# EAGLE design PiCB (EAGLE 8.0.1)
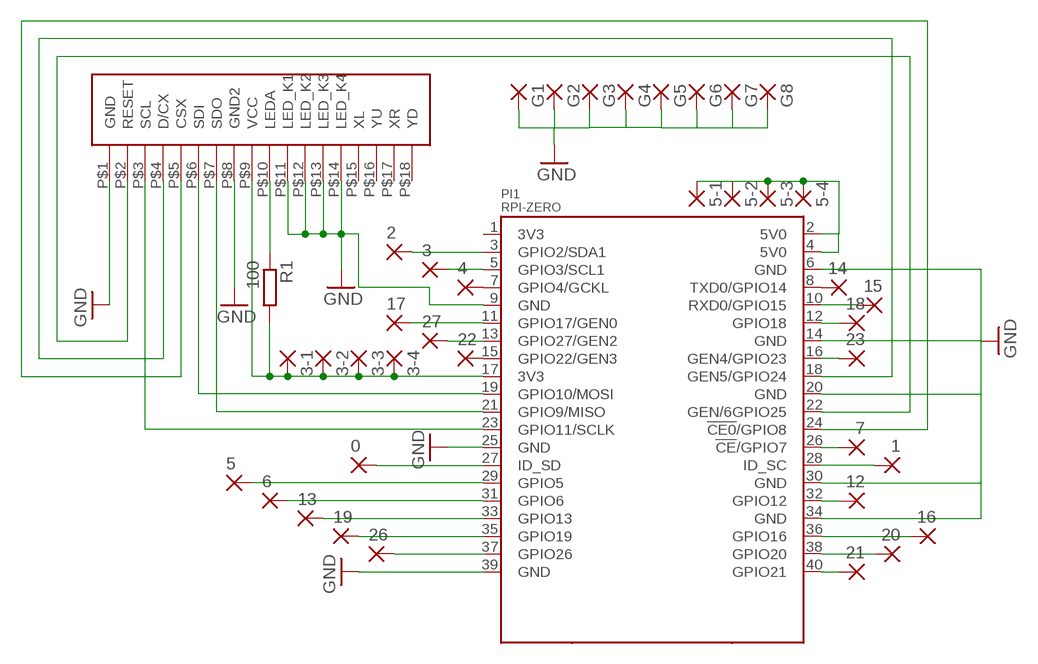
[diagram p0: schematic, sheet 1]

## Parts
0  1,6/0,8  [1,6/0,8]
1  1,6/0,8  [1,6/0,8]
2  1,6/0,8  [1,6/0,8]
3  1,6/0,8  [1,6/0,8]
3-1  1,6/0,8  [1,6/0,8]
3-2  1,6/0,8  [1,6/0,8]
3-3  1,6/0,8  [1,6/0,8]
3-4  1,6/0,8  [1,6/0,8]
4  1,6/0,8  [1,6/0,8]
5  1,6/0,8  [1,6/0,8]
5-1  1,6/0,8  [1,6/0,8]
5-2  1,6/0,8  [1,6/0,8]
5-3  1,6/0,8  [1,6/0,8]
5-4  1,6/0,8  [1,6/0,8]
6  1,6/0,8  [1,6/0,8]
7  1,6/0,8  [1,6/0,8]
12  1,6/0,8  [1,6/0,8]
13  1,6/0,8  [1,6/0,8]
14  1,6/0,8  [1,6/0,8]
15  1,6/0,8  [1,6/0,8]
16  1,6/0,8  [1,6/0,8]
17  1,6/0,8  [1,6/0,8]
18  1,6/0,8  [1,6/0,8]
19  1,6/0,8  [1,6/0,8]
20  1,6/0,8  [1,6/0,8]
21  1,6/0,8  [1,6/0,8]
22  1,6/0,8  [1,6/0,8]
23  1,6/0,8  [1,6/0,8]
26  1,6/0,8  [1,6/0,8]
27  1,6/0,8  [1,6/0,8]
G1  1,6/0,8  [1,6/0,8]
G2  1,6/0,8  [1,6/0,8]
G3  1,6/0,8  [1,6/0,8]
G4  1,6/0,8  [1,6/0,8]
G5  1,6/0,8  [1,6/0,8]
G6  1,6/0,8  [1,6/0,8]
G7  1,6/0,8  [1,6/0,8]
G8  1,6/0,8  [1,6/0,8]
PI1  RPI-ZERO  [RASPBERRYPI_BASTELSTUBE_V13_RASPI_BOARD_B+_FULL]
R1  100  R-EU_R0805  [R0805]
U$2  ILI9341-2.8  [ILI9341-2.8]

## Nets
5V0@2: 5-1.1(P) 5-2.1(P) 5-3.1(P) 5-4.1(P) PI1.2(5V0) PI1.4(5V0)
GND: G1.1(P) G2.1(P) G3.1(P) G4.1(P) G5.1(P) G6.1(P) G7.1(P) G8.1(P) PI1.39(GND) U$2.P$1(GND) U$2.P$8(GND2)
GND@1: PI1.9(GND) U$2.P$11(LED_K1) U$2.P$12(LED_K2) U$2.P$13(LED_K3) U$2.P$14(LED_K4) ; supply symbol labelled GND
GND@2: PI1.25(GND) ; supply symbol labelled GND
GND@7: PI1.6(GND) PI1.14(GND) PI1.20(GND) PI1.30(GND) PI1.34(GND) ; supply symbol labelled GND
N$1: PI1.22(GEN/6GPIO25) U$2.P$2(RESET)
N$2: PI1.23(GPIO11/SCLK) U$2.P$3(SCL)
N$3: PI1.19(GPIO10/MOSI) U$2.P$6(SDI)
N$4: PI1.21(GPIO9/MISO) U$2.P$7(SDO)
N$5: R1.1 U$2.P$10(LEDA)
N$6: PI1.18(GEN5/GPIO24) U$2.P$4(D/CX)
N$7: PI1.24(!CE0!/GPIO8) U$2.P$5(CSX)
N$8: 26.1(P) PI1.37(GPIO26)
N$9: 19.1(P) PI1.35(GPIO19)
N$10: 13.1(P) PI1.33(GPIO13)
N$11: 6.1(P) PI1.31(GPIO6)
N$12: 5.1(P) PI1.29(GPIO5)
N$13: 21.1(P) PI1.40(GPIO21)
N$14: 20.1(P) PI1.38(GPIO20)
N$15: 16.1(P) PI1.36(GPIO16)
N$16: 12.1(P) PI1.32(GPIO12)
N$17: 7.1(P) PI1.26(!CE!/GPIO7)
N$18: 14.1(P) PI1.8(TXD0/GPIO14)
N$19: 3-1.1(P) 3-2.1(P) 3-3.1(P) 3-4.1(P) PI1.17(3V3) R1.2 U$2.P$9(VCC)
N$20: 23.1(P) PI1.16(GEN4/GPIO23)
N$21: 18.1(P) PI1.12(GPIO18)
N$22: 15.1(P) PI1.10(RXD0/GPIO15)
N$23: 22.1(P) PI1.15(GPIO22/GEN3)
N$24: 4.1(P) PI1.7(GPIO4/GCKL)
N$25: 27.1(P) PI1.13(GPIO27/GEN2)
N$26: 17.1(P) PI1.11(GPIO17/GEN0)
N$27: 3.1(P) PI1.5(GPIO3/SCL1)
N$28: 2.1(P) PI1.3(GPIO2/SDA1)
N$31: 0.1(P) PI1.27(ID_SD)
N$32: 1.1(P) PI1.28(ID_SC)
Unconnected: PI1.1(3V3) U$2.P$15(XL) U$2.P$16(YU) U$2.P$17(XR) U$2.P$18(YD)

## Library data of the parts
0 1-3 3-1-3-4 4 5 5-1-5-4 6 7 12-23 26 27 G1-G8 = wirepad:1,6/0,8: THROUGH-HOLE PAD
PI1 = RPI-Zero:RPI-ZERO
R1 = resistor:R-EU_: RESISTOR, European symbol
U$2 = ili9341:ILI9341-2.8

## Board
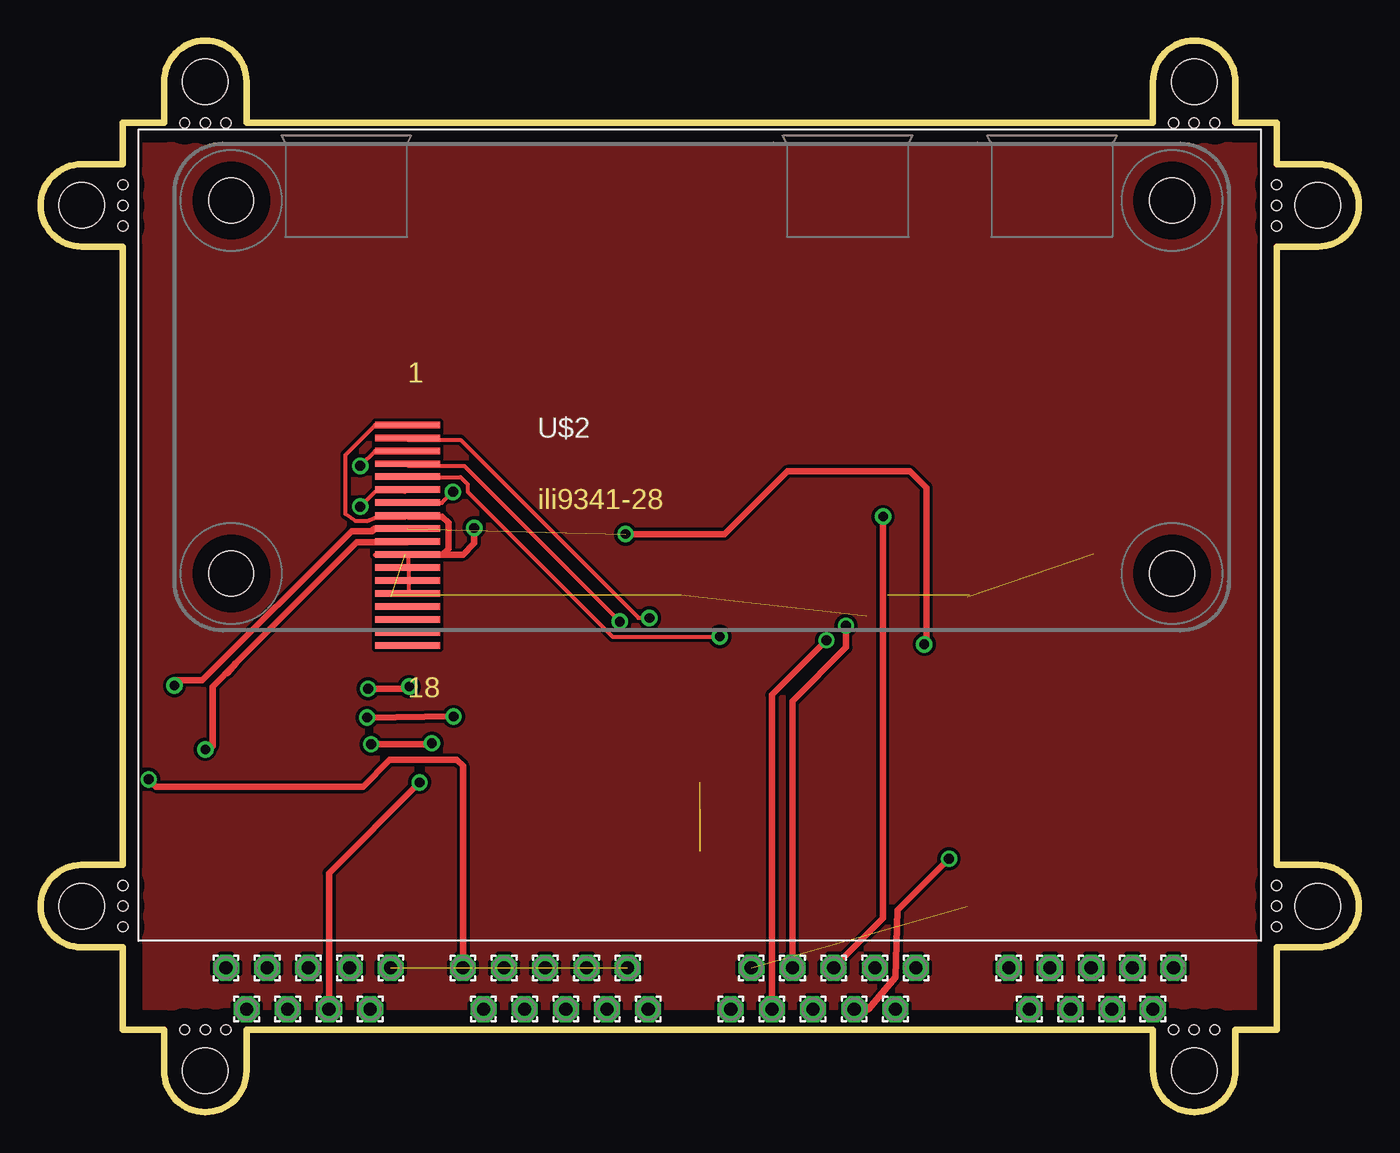
[diagram p1: board, top side]
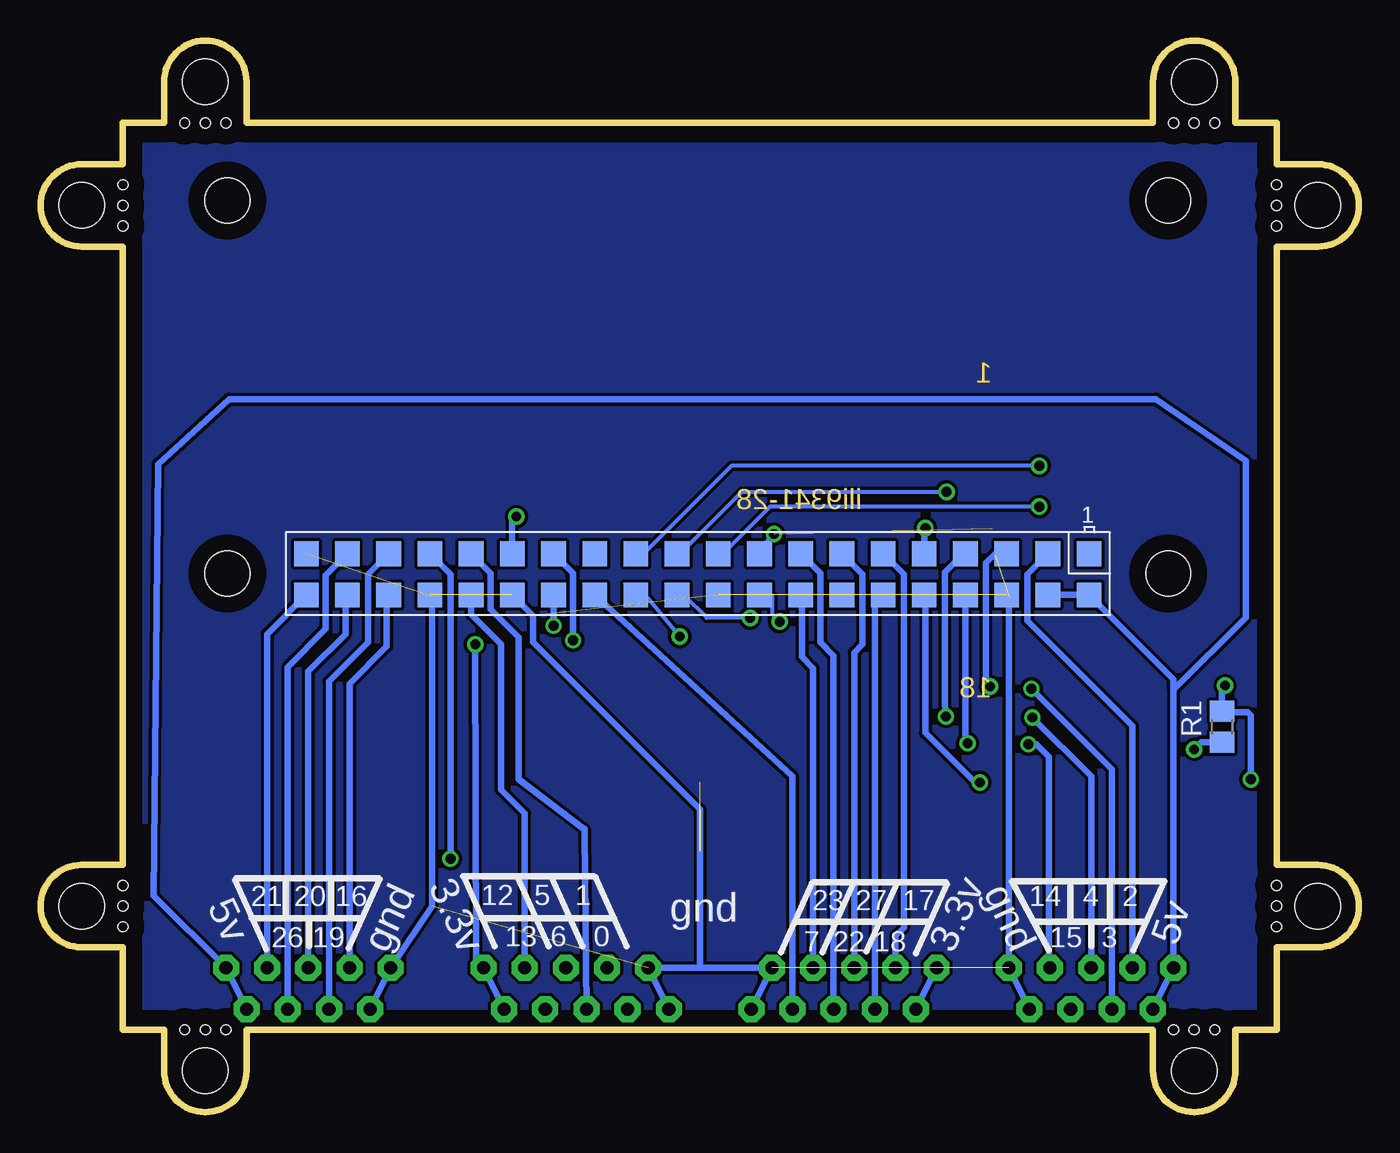
[diagram p2: board, bottom side, seen from below]

Size 81.28 x 66.04 mm. Coordinates in mm from the lower left corner, seen from the top.
Outline: 2.54,58.42 5.08,58.42 5.08,60.96 7.62,60.96 7.62,63.5 arc-180 12.7,63.5 12.7,60.96 68.58,60.96 68.58,63.5 arc-180 73.66,63.5 73.66,60.96 76.2,60.96 76.2,58.42 78.74,58.42 arc-180 78.74,53.34 76.2,53.34 76.2,15.24 78.74,15.24 arc-180 78.74,10.16 76.2,10.16 76.2,5.08 73.66,5.08 73.66,2.54 arc-180 68.58,2.54 68.58,5.08 12.7,5.08 12.7,2.54 arc-180 7.62,2.54 7.62,5.08 5.08,5.08 5.08,10.16 2.54,10.16 arc-180 2.54,15.24 5.08,15.24 5.08,53.34 2.54,53.34 arc-180 2.54,58.42
Copper layers (1*16): Top 0.035mm / dielectric 1.5mm / Bottom 0.035mm
Design rules "default": minimum track width 10mil, minimum drill 24mil, track to track 8mil, track to pad 8mil, pad to pad 8mil, via to via 8mil, smd to smd 8mil, copper to edge 40mil, drill to drill 8mil, minimum pad ring 10mil, minimum via ring 8mil, stop-mask expansion 4mil, vias tented up to drill 0mil, thermal gap 10mil
Holes 2.8 mm at 71.12,2.54 78.74,12.7 78.74,55.88 71.12,63.5 10.16,63.5 2.54,55.88 10.16,2.54 2.54,12.7
Holes 0.6 mm at 69.85,60.96 71.12,60.96 72.39,60.96 76.2,57.15 76.2,55.88 76.2,54.61 76.2,13.97 76.2,12.7 76.2,11.43 72.39,5.08 71.12,5.08 69.85,5.08 5.08,13.97 5.08,12.7 5.08,11.43 8.89,5.08 10.16,5.08 11.43,5.08 5.08,55.88 5.08,57.15 5.08,54.61 10.16,60.96 8.89,60.96 11.43,60.96

### Footprints (pad centres in the part's own frame; a part is rotated, then mirrored left to right if it is on the bottom)
1,6/0,8 = drill 0.813 pad 1.6 octagon: 1 0,0
RASPBERRYPI_BASTELSTUBE_V13_RASPI_BOARD_B+_FULL = smd 1.524 x 1.524: 1 8.382,25.273; 2 8.382,27.813; 3 10.922,25.273; 4 10.922,27.813; 5 13.462,25.273; 6 13.462,27.813; 7 16.002,25.273; 8 16.002,27.813; 9 18.542,25.273; 10 18.542,27.813; 11 21.082,25.273; 12 21.082,27.813; 13 23.622,25.273; 14 23.622,27.813; 15 26.162,25.273; 16 26.162,27.813; 17 28.702,25.273; 18 28.702,27.813; 19 31.242,25.273; 20 31.242,27.813; 21 33.782,25.273; 22 33.782,27.813; 23 36.322,25.273; 24 36.322,27.813; 25 38.862,25.273; 26 38.862,27.813; 27 41.402,25.273; 28 41.402,27.813; 29 43.942,25.273; 30 43.942,27.813; 31 46.482,25.273; 32 46.482,27.813; 33 49.022,25.273; 34 49.022,27.813; 35 51.562,25.273; 36 51.562,27.813; 37 54.102,25.273; 38 54.102,27.813; 39 56.642,25.273; 40 56.642,27.813 | hole 2.75: 3.5,3.5; 3.5,26.5; 61.5,3.5; 61.5,26.5
R0805 = smd 1.3 x 1.5: 1 -0.95,0; 2 0.95,0
ILI9341-2.8 = smd 4 x 0.4: P$1 -18,6.8; P$2 -18,6; P$3 -18,5.2; P$4 -18,4.4; P$5 -18,3.6; P$6 -18,2.8; P$7 -18,2; P$8 -18,1.2; P$9 -18,0.4; P$10 -18,-0.4; P$11 -18,-1.2; P$12 -18,-2; P$13 -18,-2.8; P$14 -18,-3.6; P$15 -18,-4.4; P$16 -18,-5.2; P$17 -18,-6; P$18 -18,-6.8

### Placement (x,y rotation side)
0  45.09,6.35 0 top
1  46.35,8.89 0 top
2  13.97,8.89 0 top
3  15.24,6.35 0 top
3-1  26.03,8.89 0 top
3-2  27.3,6.35 0 top
3-3  53.98,8.89 0 top
3-4  52.7,6.35 0 top
4  16.51,8.89 0 top
5  48.89,8.89 0 top
5-1  11.43,8.89 0 top
5-2  12.7,6.35 0 top
5-3  69.85,8.89 0 top
5-4  68.58,6.35 0 top
6  47.62,6.35 0 top
7  34.92,6.35 0 top
12  51.43,8.89 0 top
13  50.16,6.35 0 top
14  19.05,8.89 0 top
15  17.78,6.35 0 top
16  62.23,8.89 0 top
17  28.58,8.89 0 top
18  29.84,6.35 0 top
19  63.5,6.35 0 top
20  64.77,8.89 0 top
21  67.31,8.89 0 top
22  32.38,6.35 0 top
23  33.66,8.89 0 top
26  66.04,6.35 0 top
27  31.12,8.89 0 top
G1  21.59,8.89 0 top
G2  20.32,6.35 0 top
G3  36.2,8.89 0 top
G4  37.46,6.35 0 top
G5  43.81,8.89 0 top
G6  42.55,6.35 0 top
G7  59.69,8.89 0 top
G8  60.96,6.35 0 top
PI1  8.25,59.69 180 bottom
R1  8.45,23.75 90 bottom
U$2  40.64,35.56 0 top

### Tracks (layer width: path | path; a pad name or v marks a point on that pad's centre or on a via)
5V0@2
  Bottom 0.406: PI1.4 PI1.2 11.43,26.67 11.43,26.04 | 11.43,26.04 5-1.1 5-2.1 | 5-4.1 5-3.1 74.3,13.34 74.04,39.94 69.66,43.94 12.51,43.94 6.99,40.13 6.99,30.48 11.43,26.04
GND  (4 unrouted)
  Top 0.254: 22.45,34.34 20.62,34.34 | U$2.P$8 22.45,36.63 20.62,36.63 20.1,36.42 19.42,36.42 18.8,36.86 18.8,40.51 20.62,42.34 22.45,42.34 U$2.P$1
  Top 0.406: U$2.P$8 22.7,36.7 24.77,36.7 25.15,36.32 25.15,34.73 24.75,34.34 22.45,34.34
  Bottom 0.406: G8.1 G7.1 57.15,12.7 57.15,31.75 | G2.1 G1.1 21.59,31.75 | G4.1 G3.1 G5.1 G6.1
GND@1  (via drill 0.6)
  Top 0.254: 22.68,32.74 22.68,33.43 U$2.P$12 22.68,33.66 22.68,34.34 U$2.P$11 | 22.68,32.74 22.68,32.06 U$2.P$14 | 22.68,32.74 U$2.P$13
  Top 0.406: U$2.P$11 26.03,34.35 26.73,35.05 v26.73,36
  Bottom 0.406: v26.73,36 26.8,35.94 PI1.9
GND@7  (6 unrouted)
  Bottom 0.406: 40.64,8.89 40.64,18.67 50.93,28.96 50.93,30.61 PI1.30
N$1  (via drill 0.61)
  Top 0.254: v37.54,30.46 36.85,30.46 25.88,41.43 22.68,41.43 U$2.P$2
  Bottom 0.254: v37.54,30.46 40.21,30.46 41.58,31.83 PI1.22
N$2  (via drill 0.61)
  Top 0.254: v19.71,39.83 20.62,40.74 22.45,40.74 U$2.P$3
  Bottom 0.254: v19.71,39.83 38.7,39.83 43.95,34.57 43.94,34.57 PI1.23
N$3  (via drill 0.61)
  Top 0.254: v19.71,37.31 20.62,38.23 22.45,38.23 U$2.P$6
  Bottom 0.254: v19.71,37.31 36.31,37.31 39.05,34.57 39.32,34.44 PI1.19
N$4  (via drill 0.61)
  Top 0.254: v25.42,38.23 24.74,37.54 22.68,37.54 U$2.P$7
  Bottom 0.254: v25.42,38.23 38.04,38.23 41.69,34.57 41.77,34.44 PI1.21
N$5  (via drill 0.6)
  Top 0.406: U$2.P$10 22.59,35.12 19.49,35.12 12.07,27.69 | 12.07,27.69 11.49,27.05 | 12.07,27.69 10.6,26.23 10.6,22.54 10.41,22.35 v10.16,22.35
  Bottom 0.406: v10.16,22.35 9.71,22.8 R1.1
N$6  (via drill 0.61)
  Top 0.254: v35.71,30.23 26.11,39.83 22.68,39.83 U$2.P$4
  Bottom 0.254: v35.71,30.23 36.17,30.68 36.17,31.83 PI1.18
N$7  (via drill 0.61)
  Top 0.254: v41.87,29.31 35.26,29.31 26.34,38.23 26.34,38.68 25.88,39.14 22.68,39.14 U$2.P$5
  Bottom 0.254: v41.87,29.31 43.94,31.83 PI1.24
N$8
  Bottom 0.406: PI1.37 63.69,33.08 63.69,29.78 66.04,27.43 26.1
N$9
  Bottom 0.406: PI1.35 61.09,33.15 61.09,28.96 63.5,26.54 19.1
N$10  (via drill 0.6)
  Top 0.406: v56.01,15.62 52.83,12.45 52.7,8.32 51.05,6.35 13.1
  Bottom 0.406: PI1.33 56.01,33.15 v56.01,15.62
N$11
  Bottom 0.406: PI1.31 53.53,33.21 53.53,30.99 51.82,29.27 51.82,20.51 47.82,17.46 47.75,17.46 47.75,17.27 6.1
N$12  (via drill 0.6)
  Top 0.406: 5.1 51.94,11.94 v51.94,36.7
  Bottom 0.406: v51.94,36.7 52.2,36.45 PI1.29
N$13
  Bottom 0.406: PI1.40 67.31,29.46 21.1
N$14
  Bottom 0.406: PI1.38 62.48,31.75 62.48,29.46 64.77,27.18 20.1
N$15
  Bottom 0.406: PI1.36 59.94,31.75 59.94,28.7 62.23,26.42 16.1
N$16
  Bottom 0.406: 12.1 51.43,18.42 52.9,19.88 52.9,28.83 54.74,30.67 PI1.32
N$17
  Bottom 0.406: PI1.26 34.92,20.7 7.1
N$18  (via drill 0.6)
  Top 0.406: v20.38,22.67 24.13,22.67 v24.13,22.73
  Bottom 0.406: 14.1 19.11,8.95 19.11,21.91 19.88,22.67 v20.38,22.67 | v24.13,22.73 24.26,22.73 PI1.8
N$19  (via drill 0.6)  (1 unrouted)
  Top 0.406: U$2.P$9 22.62,35.94 20.57,35.94 20.45,35.81 19.18,35.81 9.97,26.61 8.25,26.61 v8.25,26.29 | v6.67,20.51 7.11,20.07 19.88,20.07 21.53,21.72 25.65,21.72 26.03,21.34 3-1.1 | v54.48,28.83 54.61,28.96 54.61,38.48 53.59,39.5 46.04,39.5 42.16,35.62 v36.07,35.62
  Bottom 0.406: 3-2.1 3-1.1 | 3-4.1 3-3.1 54.42,9.21 v54.48,28.83 | v8.25,26.29 8.45,26.1 R1.2 8.38,24.64 6.86,24.64 6.67,24.45 v6.67,20.51 | PI1.17 v36.07,35.62
N$20
  Bottom 0.406: PI1.16 34.35,31.81 34.35,28.07 33.66,27.37 23.1
N$21
  Bottom 0.406: PI1.12 29.84,31.37 18.1
N$22  (via drill 0.6)
  Top 0.406: v23.37,20.32 17.78,14.73 15.1
  Bottom 0.406: PI1.10 26.73,31.81 26.73,23.37 23.69,20.32 v23.37,20.32
N$23
  Bottom 0.406: PI1.15 33.21,33.21 33.21,28.96 32.38,28.13 22.1
N$24  (via drill 0.6)
  Top 0.406: v20.13,24.32 v25.46,24.38
  Bottom 0.406: v25.46,24.38 25.53,25.15 25.53,33.27 24.38,34.42 PI1.7 | v20.13,24.32 16.51,20.7 4.1
N$25
  Bottom 0.406: PI1.13 30.61,33.15 30.61,28.83 31.12,28.32 27.1
N$26
  Bottom 0.406: PI1.11 28.07,33.15 28.07,11.37 28.58,10.86 17.1
N$27  (via drill 0.6)
  Top 0.406: v20.19,26.1 22.73,26.1 v22.73,26.23
  Bottom 0.406: 20.07,26.16 20.13,26.1 v20.19,26.1 15.24,21.15 3.1 | v22.73,26.23 22.99,26.48 22.99,33.85 22.41,34.42 PI1.5
N$28
  Bottom 0.406: PI1.3 20.45,33.15 20.45,30.29 13.97,23.81 2.1
N$29
  pour Top: 5.08,60.96 5.08,5.08 76.2,5.08 76.2,60.96
N$30
  pour Bottom: 5.08,60.96 76.2,60.96 76.2,5.08 5.08,5.08
N$31  (via drill 0.6)
  Top 0.406: v48.45,29.08 45.09,25.72 0.1
  Bottom 0.406: PI1.27 48.45,33.21 v48.45,29.08
N$32  (via drill 0.6)
  Top 0.406: 1.1 46.35,25.34 49.66,28.64 v49.66,29.97
  Bottom 0.406: PI1.28 v49.66,29.97

### Text on the board
bNames: gnd | 5v | gnd | 5v | gnd | 3.3v | 3.3v